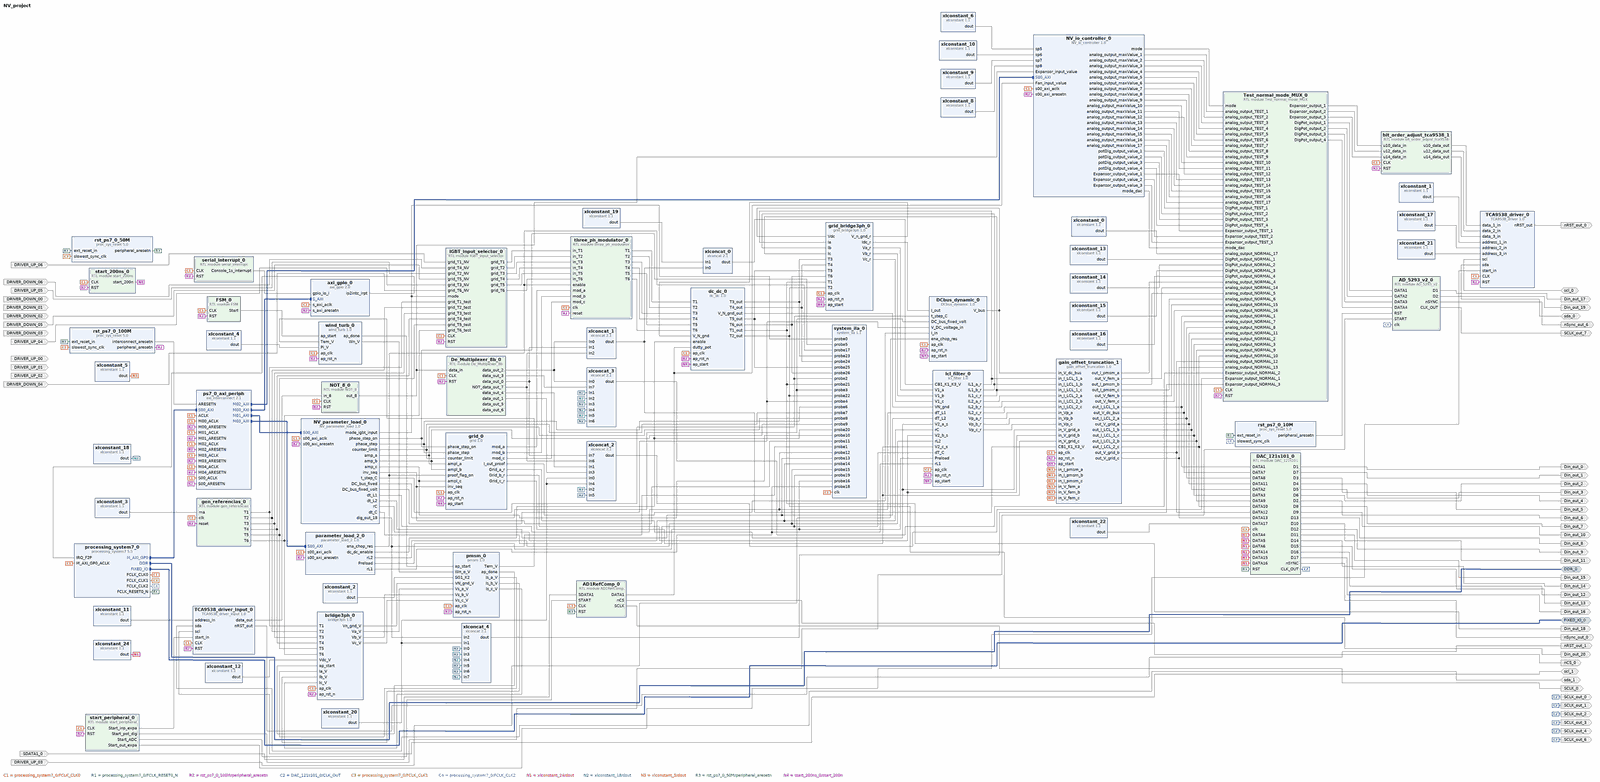
[diagram p0: block diagram of the top level, whole]
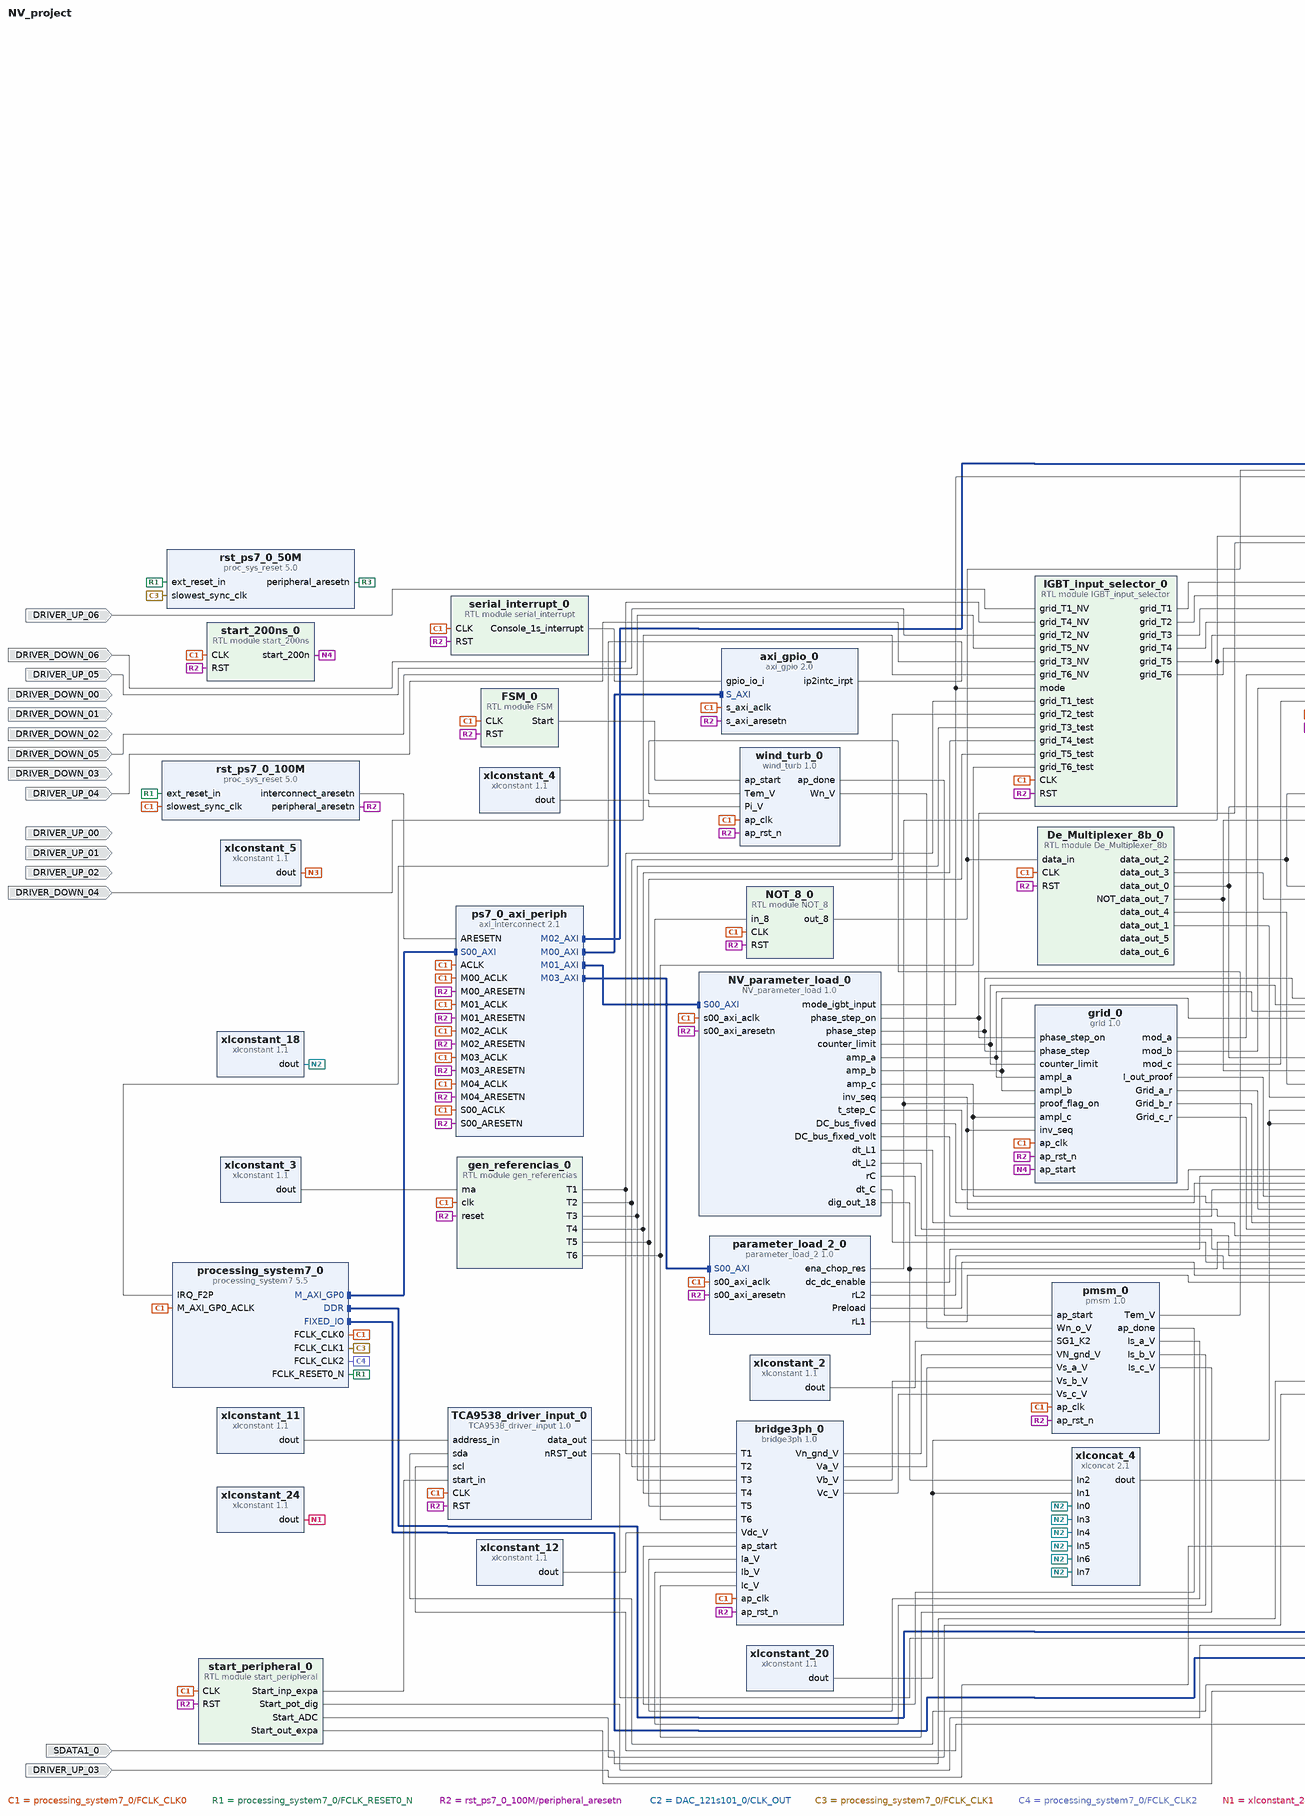
[diagram p1: block diagram of the top level, left part]
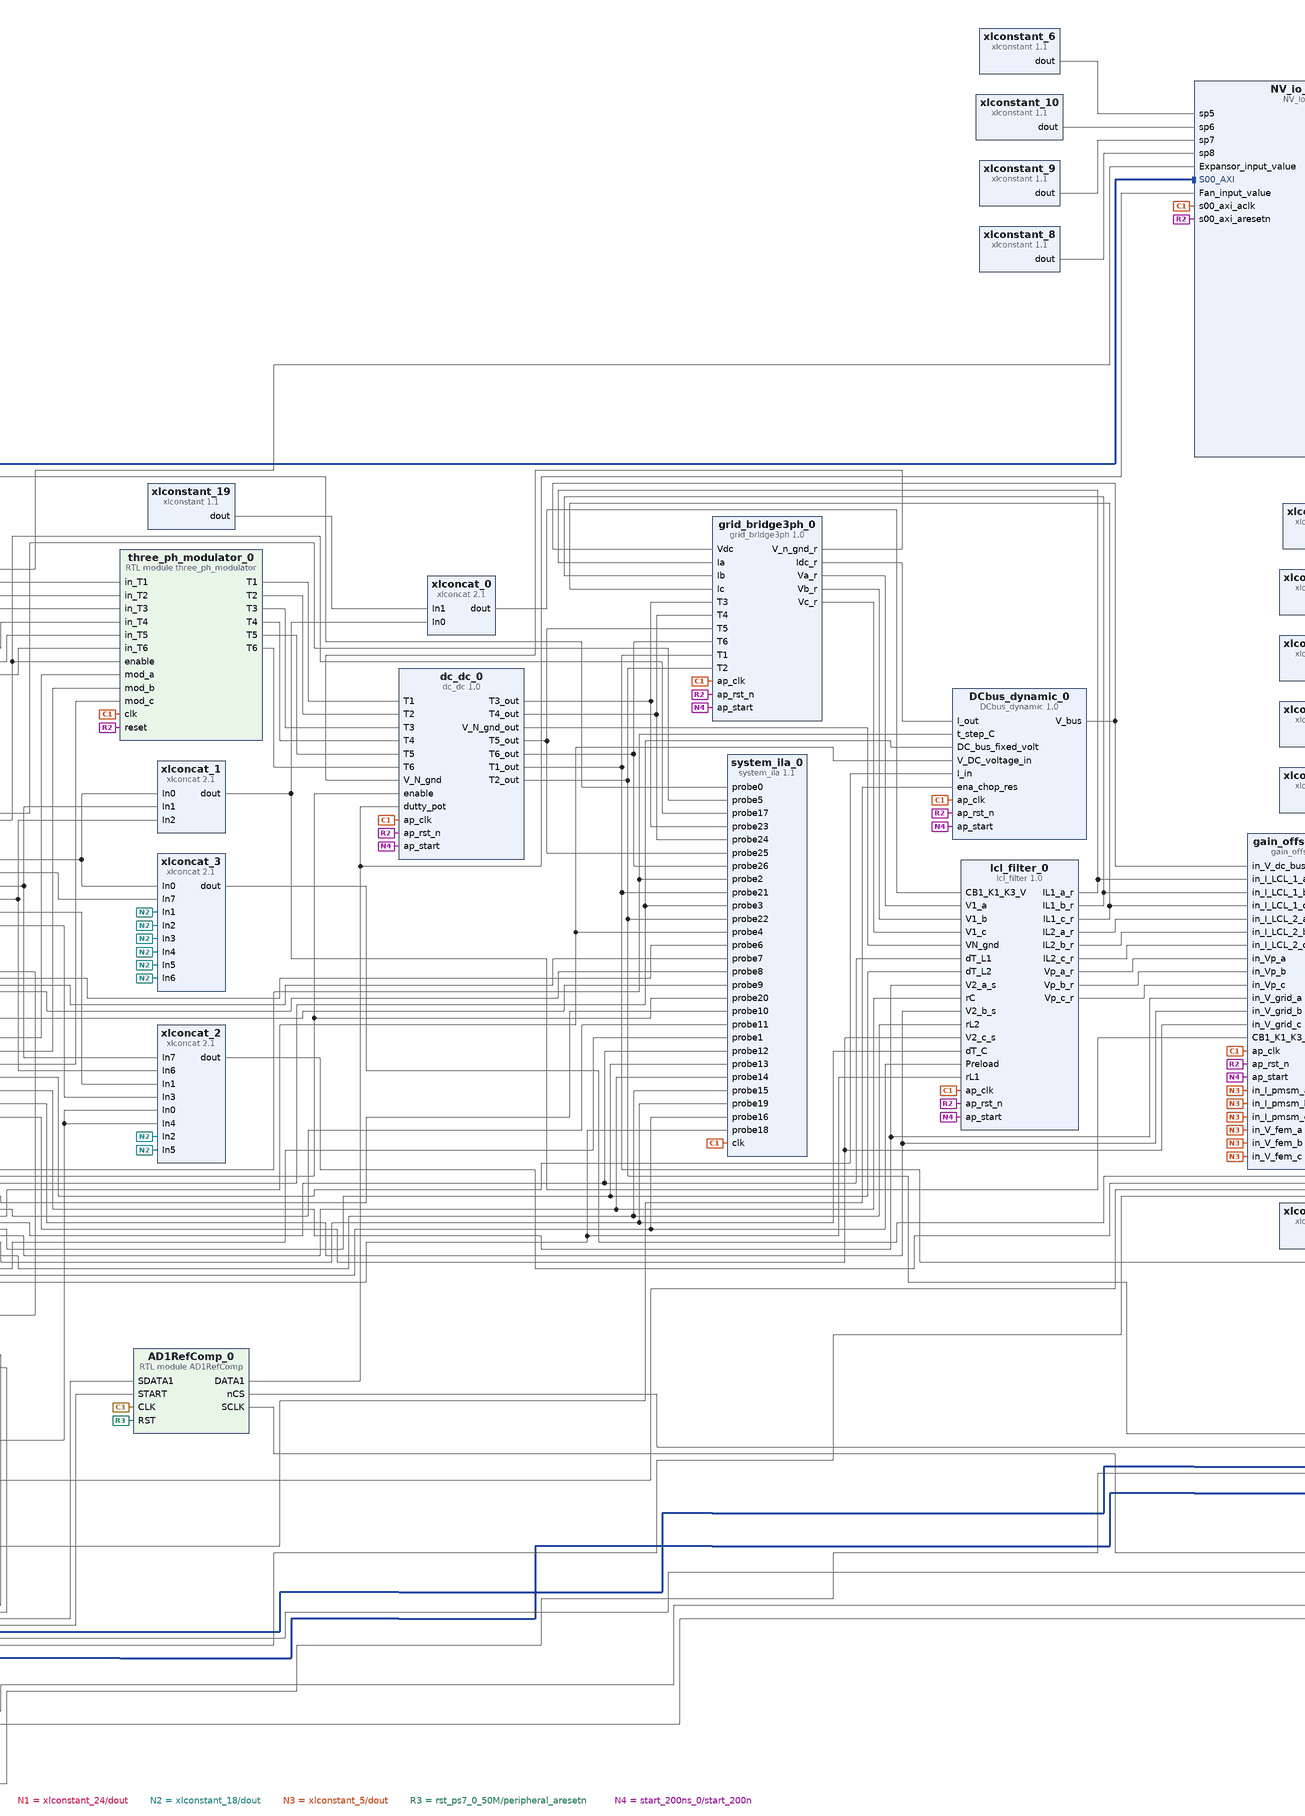
[diagram p2: block diagram of the top level, centre part]
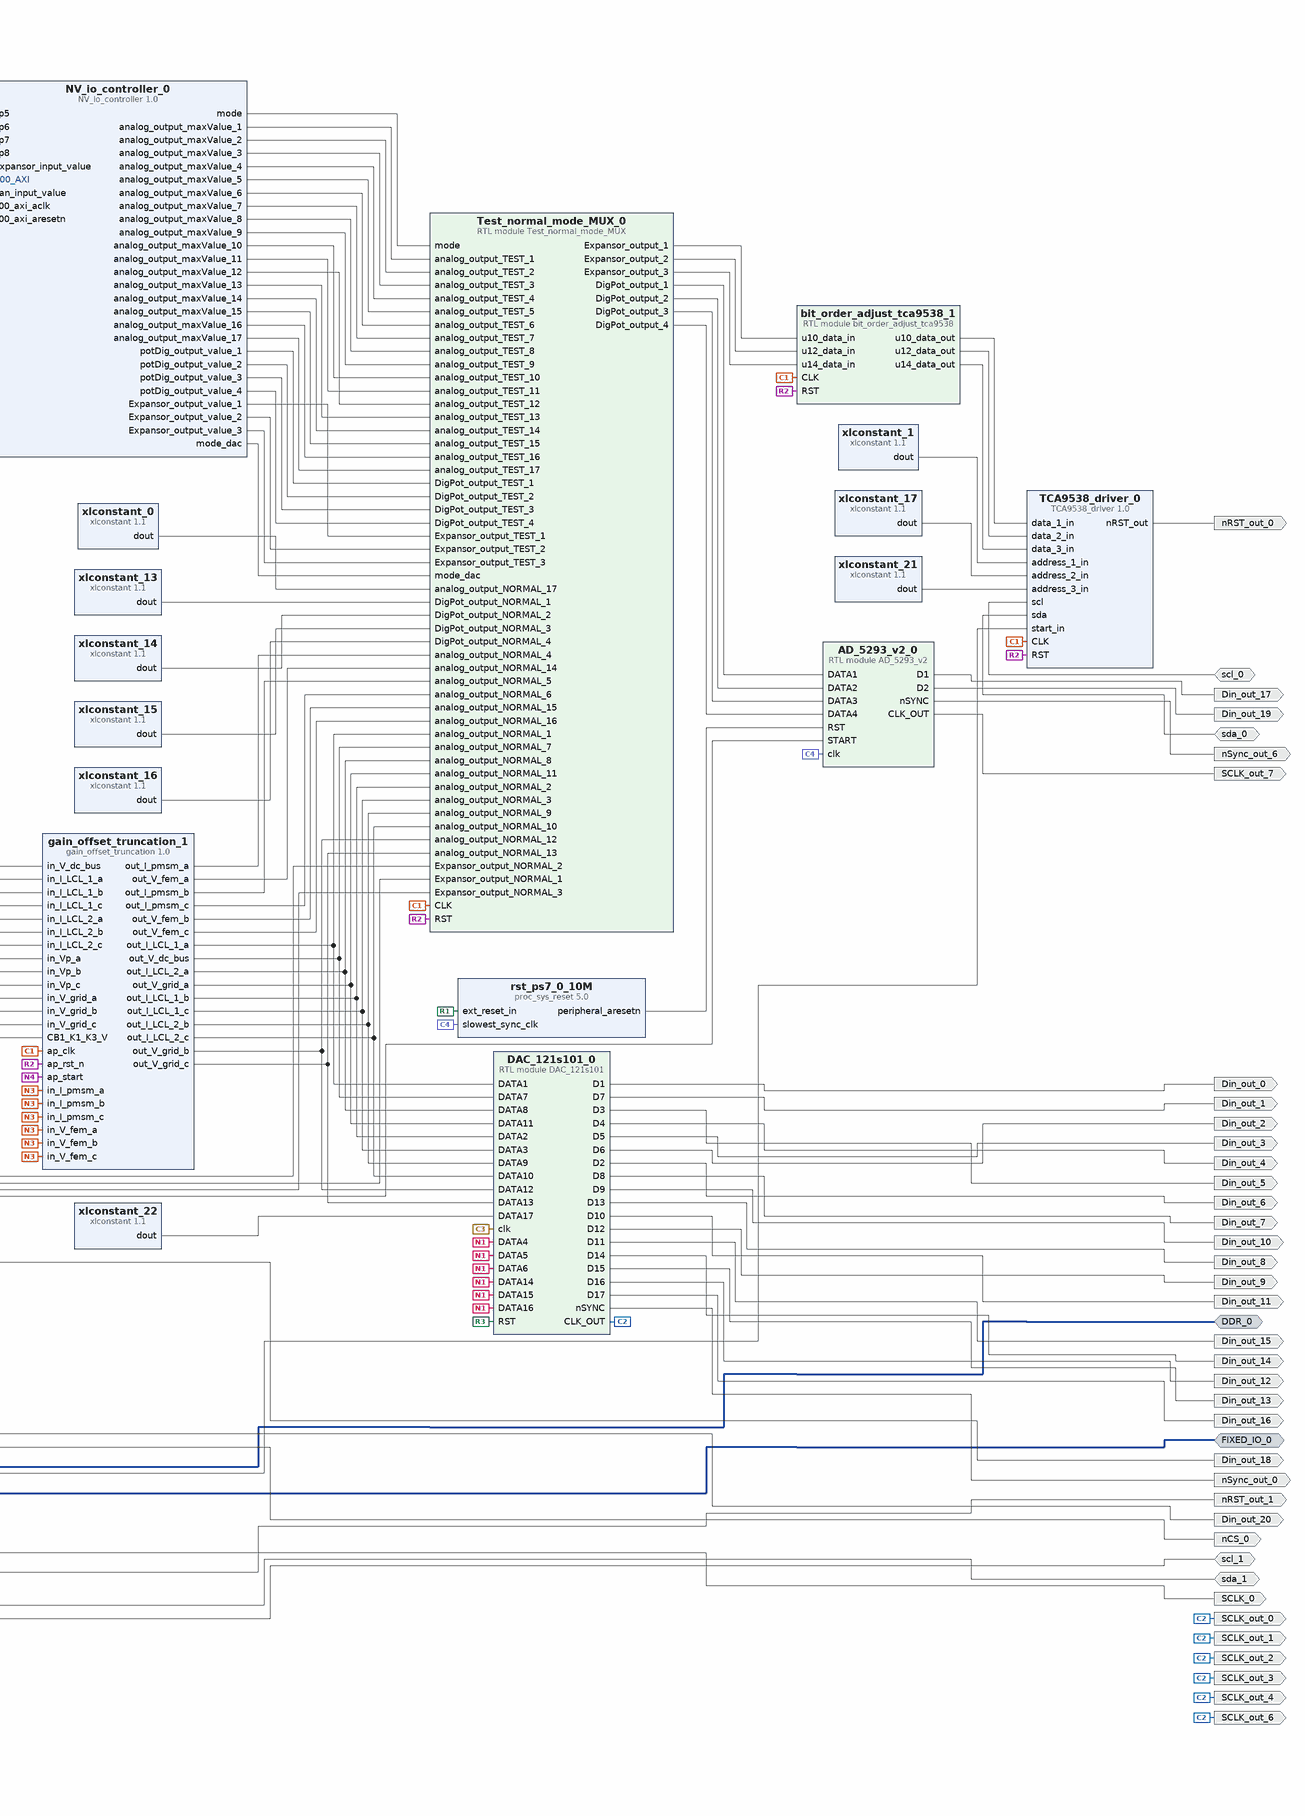
[diagram p3: block diagram of the top level, right part]
# Vivado block design NV_project, xc7z020clg400-1, Vivado 2017.4
create_bd_design NV_project

create_bd_intf_port -mode Master -vlnv xilinx.com:interface:ddrx_rtl:1.0 DDR_0
create_bd_intf_port -mode Master -vlnv xilinx.com:display_processing_system7:fixedio_rtl:1.0 FIXED_IO_0
create_bd_port -dir I DRIVER_DOWN_03
create_bd_port -dir I DRIVER_UP_00
create_bd_port -dir I DRIVER_DOWN_00
create_bd_port -dir I DRIVER_UP_01
create_bd_port -dir I DRIVER_DOWN_01
create_bd_port -dir I DRIVER_UP_02
create_bd_port -dir I DRIVER_DOWN_02
create_bd_port -dir O nRST_out_1
create_bd_port -dir IO sda_1
create_bd_port -dir IO scl_1
create_bd_port -dir O Din_out_0
create_bd_port -dir O Din_out_6
create_bd_port -dir O Din_out_5
create_bd_port -dir O Din_out_4
create_bd_port -dir O Din_out_3
create_bd_port -dir O Din_out_2
create_bd_port -dir O Din_out_1
create_bd_port -dir O Din_out_7
create_bd_port -dir O Din_out_10
create_bd_port -dir O Din_out_11
create_bd_port -dir O Din_out_15
create_bd_port -dir O Din_out_9
create_bd_port -dir O Din_out_8
create_bd_port -dir O Din_out_14
create_bd_port -dir O Din_out_13
create_bd_port -dir O Din_out_12
create_bd_port -dir O Din_out_16
create_bd_port -dir O SCLK_out_0
create_bd_port -dir O SCLK_out_1
create_bd_port -dir O SCLK_out_2
create_bd_port -dir O SCLK_out_3
create_bd_port -dir O SCLK_out_4
create_bd_port -dir O SCLK_out_6
create_bd_port -dir O nSync_out_0
create_bd_port -dir O SCLK_out_7
create_bd_port -dir O nSync_out_6
create_bd_port -dir O Din_out_19
create_bd_port -dir O Din_out_18
create_bd_port -dir O Din_out_20
create_bd_port -dir O nCS_0
create_bd_port -dir O SCLK_0
create_bd_port -dir I SDATA1_0
create_bd_port -dir O nRST_out_0
create_bd_port -dir IO sda_0
create_bd_port -dir IO scl_0
create_bd_port -dir I DRIVER_UP_06
create_bd_port -dir I DRIVER_DOWN_06
create_bd_port -dir I DRIVER_UP_05
create_bd_port -dir I DRIVER_DOWN_05
create_bd_port -dir I DRIVER_UP_04
create_bd_port -dir I DRIVER_DOWN_04
create_bd_port -dir I DRIVER_UP_03
create_bd_port -dir O Din_out_17

create_bd_cell -type ip -vlnv xilinx.com:hls:wind_turb:1.0 wind_turb_0
create_bd_cell -type ip -vlnv xilinx.com:hls:pmsm:1.0 pmsm_0
create_bd_cell -type ip -vlnv xilinx.com:hls:bridge3ph:1.0 bridge3ph_0
create_bd_cell -type ip -vlnv xilinx.com:ip:xlconstant:1.1 xlconstant_2
set_property -dict {CONFIG.CONST_WIDTH 1 CONFIG.CONST_VAL 0} [get_bd_cells xlconstant_2]
create_bd_cell -type ip -vlnv xilinx.com:ip:xlconstant:1.1 xlconstant_3
set_property -dict {CONFIG.CONST_WIDTH 11 CONFIG.CONST_VAL 254} [get_bd_cells xlconstant_3]
create_bd_cell -type ip -vlnv xilinx.com:ip:processing_system7:5.5 processing_system7_0
set_property -dict [list \
  CONFIG.PCW_FCLK_CLK1_BUF TRUE \
  CONFIG.PCW_FCLK_CLK3_BUF TRUE \
  CONFIG.PCW_APU_PERIPHERAL_FREQMHZ 667 \
  CONFIG.PCW_SDIO_PERIPHERAL_FREQMHZ 25 \
  CONFIG.PCW_UART_PERIPHERAL_FREQMHZ 50 \
  CONFIG.PCW_FPGA0_PERIPHERAL_FREQMHZ 100 \
  CONFIG.PCW_FPGA1_PERIPHERAL_FREQMHZ 50 \
  CONFIG.PCW_FPGA2_PERIPHERAL_FREQMHZ 10 \
  CONFIG.PCW_FPGA3_PERIPHERAL_FREQMHZ 2.5 \
  CONFIG.PCW_USE_FABRIC_INTERRUPT 1 \
  CONFIG.PCW_EN_CLK1_PORT 1 \
  CONFIG.PCW_EN_CLK2_PORT 1 \
  CONFIG.PCW_EN_CLK3_PORT 1 \
  CONFIG.PCW_IRQ_F2P_INTR 1 \
  CONFIG.PCW_PRESET_BANK1_VOLTAGE {LVCMOS 1.8V} \
  CONFIG.PCW_UIPARAM_DDR_PARTNO {MT41K256M16 RE-125} \
  CONFIG.PCW_QSPI_PERIPHERAL_ENABLE 1 \
  CONFIG.PCW_QSPI_QSPI_IO {MIO 1 .. 6} \
  CONFIG.PCW_QSPI_GRP_SINGLE_SS_ENABLE 1 \
  CONFIG.PCW_QSPI_GRP_SINGLE_SS_IO {MIO 1 .. 6} \
  CONFIG.PCW_SINGLE_QSPI_DATA_MODE x4 \
  CONFIG.PCW_QSPI_GRP_FBCLK_ENABLE 1 \
  CONFIG.PCW_QSPI_GRP_FBCLK_IO {MIO 8} \
  CONFIG.PCW_ENET0_PERIPHERAL_ENABLE 1 \
  CONFIG.PCW_ENET0_ENET0_IO {MIO 16 .. 27} \
  CONFIG.PCW_ENET0_GRP_MDIO_ENABLE 1 \
  CONFIG.PCW_ENET0_GRP_MDIO_IO {MIO 52 .. 53} \
  CONFIG.PCW_ENET_RESET_ENABLE 1 \
  CONFIG.PCW_ENET_RESET_SELECT {Share reset pin} \
  CONFIG.PCW_ENET0_RESET_ENABLE 0 \
  CONFIG.PCW_SD0_PERIPHERAL_ENABLE 1 \
  CONFIG.PCW_SD0_SD0_IO {MIO 40 .. 45} \
  CONFIG.PCW_SD0_GRP_CD_ENABLE 1 \
  CONFIG.PCW_SD0_GRP_CD_IO {MIO 46} \
  CONFIG.PCW_SD0_GRP_WP_ENABLE 1 \
  CONFIG.PCW_SD0_GRP_WP_IO {MIO 50} \
  CONFIG.PCW_UART1_PERIPHERAL_ENABLE 1 \
  CONFIG.PCW_UART1_UART1_IO {MIO 48 .. 49} \
  CONFIG.PCW_TTC0_PERIPHERAL_ENABLE 1 \
  CONFIG.PCW_TTC0_TTC0_IO EMIO \
  CONFIG.PCW_USB0_PERIPHERAL_ENABLE 1 \
  CONFIG.PCW_USB0_USB0_IO {MIO 28 .. 39} \
  CONFIG.PCW_USB_RESET_ENABLE 1 \
  CONFIG.PCW_USB_RESET_SELECT {Share reset pin} \
  CONFIG.PCW_USB0_RESET_ENABLE 1 \
  CONFIG.PCW_USB0_RESET_IO {MIO 7} \
  CONFIG.PCW_I2C_RESET_ENABLE 0 \
  CONFIG.PCW_GPIO_PERIPHERAL_ENABLE 1 \
  CONFIG.PCW_GPIO_MIO_GPIO_ENABLE 1 \
  CONFIG.PCW_GPIO_MIO_GPIO_IO MIO \
  CONFIG.PCW_FPGA_FCLK1_ENABLE 1 \
  CONFIG.PCW_FPGA_FCLK2_ENABLE 1 \
  CONFIG.PCW_FPGA_FCLK3_ENABLE 1 \
] [get_bd_cells processing_system7_0]
# 272 more settings of processing_system7_0 are not shown: defaults, MIO pin electricals, DDR timing, and values the tool derives
create_bd_cell -type ip -vlnv xilinx.com:ip:axi_gpio:2.0 axi_gpio_0
set_property -dict {CONFIG.C_GPIO_WIDTH 1 CONFIG.C_ALL_INPUTS 1 CONFIG.C_INTERRUPT_PRESENT 1} [get_bd_cells axi_gpio_0]
create_bd_cell -type ip -vlnv xilinx.com:ip:axi_interconnect:2.1 ps7_0_axi_periph
set_property -dict {CONFIG.NUM_MI 5} [get_bd_cells ps7_0_axi_periph]
create_bd_cell -type ip -vlnv xilinx.com:ip:proc_sys_reset:5.0 rst_ps7_0_100M
create_bd_cell -type ip -vlnv xilinx.com:ip:xlconstant:1.1 xlconstant_6
set_property -dict {CONFIG.CONST_WIDTH 16 CONFIG.CONST_VAL 0} [get_bd_cells xlconstant_6]
create_bd_cell -type ip -vlnv xilinx.com:ip:xlconstant:1.1 xlconstant_8
set_property -dict {CONFIG.CONST_WIDTH 16 CONFIG.CONST_VAL 0} [get_bd_cells xlconstant_8]
create_bd_cell -type ip -vlnv xilinx.com:ip:xlconstant:1.1 xlconstant_9
set_property -dict {CONFIG.CONST_WIDTH 16 CONFIG.CONST_VAL 0} [get_bd_cells xlconstant_9]
create_bd_cell -type ip -vlnv xilinx.com:ip:xlconstant:1.1 xlconstant_10
set_property -dict {CONFIG.CONST_WIDTH 16 CONFIG.CONST_VAL 0} [get_bd_cells xlconstant_10]
create_bd_cell -type ip -vlnv xilinx.com:ip:xlconstant:1.1 xlconstant_0
set_property -dict {CONFIG.CONST_WIDTH 12 CONFIG.CONST_VAL 2048} [get_bd_cells xlconstant_0]
create_bd_cell -type ip -vlnv xilinx.com:ip:xlconstant:1.1 xlconstant_13
set_property -dict {CONFIG.CONST_WIDTH 10 CONFIG.CONST_VAL 967} [get_bd_cells xlconstant_13]
create_bd_cell -type ip -vlnv xilinx.com:ip:xlconstant:1.1 xlconstant_14
set_property -dict {CONFIG.CONST_WIDTH 10 CONFIG.CONST_VAL 57} [get_bd_cells xlconstant_14]
create_bd_cell -type ip -vlnv xilinx.com:ip:xlconstant:1.1 xlconstant_15
set_property -dict {CONFIG.CONST_WIDTH 10 CONFIG.CONST_VAL 57} [get_bd_cells xlconstant_15]
create_bd_cell -type ip -vlnv xilinx.com:ip:xlconstant:1.1 xlconstant_16
set_property -dict {CONFIG.CONST_WIDTH 10 CONFIG.CONST_VAL 24} [get_bd_cells xlconstant_16]
create_bd_cell -type ip -vlnv xilinx.com:ip:xlconstant:1.1 xlconstant_18
set_property -dict {CONFIG.CONST_WIDTH 1 CONFIG.CONST_VAL 0} [get_bd_cells xlconstant_18]
create_bd_cell -type ip -vlnv xilinx.com:ip:xlconstant:1.1 xlconstant_1
set_property -dict {CONFIG.CONST_WIDTH 7 CONFIG.CONST_VAL 112} [get_bd_cells xlconstant_1]
create_bd_cell -type ip -vlnv xilinx.com:ip:xlconstant:1.1 xlconstant_17
set_property -dict {CONFIG.CONST_WIDTH 7 CONFIG.CONST_VAL 113} [get_bd_cells xlconstant_17]
create_bd_cell -type ip -vlnv xilinx.com:ip:xlconstant:1.1 xlconstant_21
set_property -dict {CONFIG.CONST_WIDTH 7 CONFIG.CONST_VAL 114} [get_bd_cells xlconstant_21]
create_bd_cell -type module -reference FSM FSM_0
create_bd_cell -type module -reference Test_normal_mode_MUX Test_normal_mode_MUX_0
create_bd_cell -type ip -vlnv xilinx.com:user:NV_io_controller:1.0 NV_io_controller_0
create_bd_cell -type ip -vlnv xilinx.com:ip:xlconstant:1.1 xlconstant_22
set_property -dict {CONFIG.CONST_WIDTH 12 CONFIG.CONST_VAL 2048} [get_bd_cells xlconstant_22]
create_bd_cell -type module -reference NOT_8 NOT_8_0
create_bd_cell -type ip -vlnv xilinx.com:ip:xlconstant:1.1 xlconstant_11
set_property -dict {CONFIG.CONST_WIDTH 7 CONFIG.CONST_VAL 112} [get_bd_cells xlconstant_11]
create_bd_cell -type module -reference DAC_121s101 DAC_121s101_0
create_bd_cell -type module -reference AD_5293_v2 AD_5293_v2_0
create_bd_cell -type ip -vlnv xilinx.com:ip:xlconstant:1.1 xlconstant_24
set_property -dict {CONFIG.CONST_WIDTH 12 CONFIG.CONST_VAL 2048} [get_bd_cells xlconstant_24]
create_bd_cell -type module -reference IGBT_input_selector IGBT_input_selector_0
create_bd_cell -type module -reference AD1RefComp AD1RefComp_0
create_bd_cell -type module -reference gen_referencias gen_referencias_0
create_bd_cell -type ip -vlnv xilinx.com:ip:xlconcat:2.1 xlconcat_1
set_property -dict {CONFIG.NUM_PORTS 3 CONFIG.IN0_WIDTH 1 CONFIG.IN1_WIDTH 1} [get_bd_cells xlconcat_1]
create_bd_cell -type ip -vlnv xilinx.com:ip:xlconcat:2.1 xlconcat_2
set_property -dict {CONFIG.NUM_PORTS 8} [get_bd_cells xlconcat_2]
create_bd_cell -type ip -vlnv xilinx.com:ip:xlconcat:2.1 xlconcat_3
set_property -dict {CONFIG.NUM_PORTS 8} [get_bd_cells xlconcat_3]
create_bd_cell -type ip -vlnv xilinx.com:ip:xlconcat:2.1 xlconcat_4
set_property -dict {CONFIG.NUM_PORTS 8} [get_bd_cells xlconcat_4]
create_bd_cell -type module -reference bit_order_adjust_tca9538 bit_order_adjust_tca9538_1
create_bd_cell -type ip -vlnv xilinx.com:ip:xlconcat:2.1 xlconcat_0
set_property -dict {CONFIG.NUM_PORTS 2 CONFIG.IN0_WIDTH 3 CONFIG.IN1_WIDTH 2} [get_bd_cells xlconcat_0]
create_bd_cell -type ip -vlnv xilinx.com:ip:xlconstant:1.1 xlconstant_19
set_property -dict {CONFIG.CONST_WIDTH 2 CONFIG.CONST_VAL 0} [get_bd_cells xlconstant_19]
create_bd_cell -type ip -vlnv xilinx.com:ip:xlconstant:1.1 xlconstant_5
set_property -dict {CONFIG.CONST_WIDTH 32 CONFIG.CONST_VAL 0} [get_bd_cells xlconstant_5]
create_bd_cell -type ip -vlnv xilinx.com:ip:xlconstant:1.1 xlconstant_20
set_property -dict {CONFIG.CONST_WIDTH 1 CONFIG.CONST_VAL 1} [get_bd_cells xlconstant_20]
create_bd_cell -type ip -vlnv xilinx.com:ip:proc_sys_reset:5.0 rst_ps7_0_50M
create_bd_cell -type ip -vlnv xilinx.com:ip:proc_sys_reset:5.0 rst_ps7_0_10M
create_bd_cell -type ip -vlnv xilinx.com:user:TCA9538_driver_input:1.0 TCA9538_driver_input_0
create_bd_cell -type module -reference start_peripheral start_peripheral_0
create_bd_cell -type ip -vlnv xilinx.com:user:TCA9538_driver:1.0 TCA9538_driver_0
create_bd_cell -type module -reference serial_interrupt serial_interrupt_0
create_bd_cell -type module -reference De_Multiplexer_8b De_Multiplexer_8b_0
create_bd_cell -type ip -vlnv xilinx.com:ip:xlconstant:1.1 xlconstant_12
set_property -dict {CONFIG.CONST_WIDTH 18 CONFIG.CONST_VAL 10} [get_bd_cells xlconstant_12]
create_bd_cell -type ip -vlnv xilinx.com:ip:xlconstant:1.1 xlconstant_4
set_property -dict {CONFIG.CONST_WIDTH 21} [get_bd_cells xlconstant_4]
create_bd_cell -type ip -vlnv xilinx.com:user:NV_parameter_load:1.0 NV_parameter_load_0
create_bd_cell -type module -reference start_200ns start_200ns_0
create_bd_cell -type ip -vlnv xilinx.com:hls:grid_bridge3ph:1.0 grid_bridge3ph_0
create_bd_cell -type ip -vlnv xilinx.com:hls:DCbus_dynamic:1.0 DCbus_dynamic_0
create_bd_cell -type module -reference three_ph_modulator three_ph_modulator_0
create_bd_cell -type ip -vlnv xilinx.com:ip:system_ila:1.1 system_ila_0
set_property -dict [list \
  CONFIG.C_PROBE26_TYPE 1 \
  CONFIG.C_PROBE25_TYPE 1 \
  CONFIG.C_PROBE24_TYPE 1 \
  CONFIG.C_PROBE23_TYPE 1 \
  CONFIG.C_PROBE22_TYPE 1 \
  CONFIG.C_PROBE21_TYPE 1 \
  CONFIG.C_PROBE20_TYPE 1 \
  CONFIG.C_PROBE19_TYPE 1 \
  CONFIG.C_PROBE18_TYPE 1 \
  CONFIG.C_PROBE17_TYPE 1 \
  CONFIG.C_PROBE16_TYPE 1 \
  CONFIG.C_PROBE15_TYPE 1 \
  CONFIG.C_PROBE14_TYPE 1 \
  CONFIG.C_PROBE13_TYPE 1 \
  CONFIG.C_PROBE12_TYPE 1 \
  CONFIG.C_PROBE11_TYPE 1 \
  CONFIG.C_PROBE10_TYPE 1 \
  CONFIG.C_PROBE9_TYPE 1 \
  CONFIG.C_PROBE8_TYPE 1 \
  CONFIG.C_PROBE7_TYPE 1 \
  CONFIG.C_PROBE6_TYPE 1 \
  CONFIG.C_PROBE5_TYPE 1 \
  CONFIG.C_PROBE4_TYPE 1 \
  CONFIG.C_PROBE3_TYPE 1 \
  CONFIG.C_PROBE2_TYPE 1 \
  CONFIG.C_PROBE1_TYPE 1 \
  CONFIG.C_PROBE0_TYPE 1 \
  CONFIG.C_NUM_OF_PROBES 27 \
  CONFIG.C_MON_TYPE NATIVE \
] [get_bd_cells system_ila_0]
create_bd_cell -type ip -vlnv xilinx.com:hls:grid:1.0 grid_0
create_bd_cell -type ip -vlnv xilinx.com:hls:lcl_filter:1.0 lcl_filter_0
create_bd_cell -type ip -vlnv xilinx.com:hls:gain_offset_truncation:1.0 gain_offset_truncation_1
create_bd_cell -type ip -vlnv xilinx.com:hls:dc_dc:1.0 dc_dc_0
create_bd_cell -type ip -vlnv xilinx.com:user:parameter_load_2:1.0 parameter_load_2_0

# ---- connections ----

connect_bd_intf_net [get_bd_intf_pins processing_system7_0/M_AXI_GP0] [get_bd_intf_pins ps7_0_axi_periph/S00_AXI]
connect_bd_intf_net [get_bd_intf_pins ps7_0_axi_periph/M00_AXI] [get_bd_intf_pins axi_gpio_0/S_AXI]
connect_bd_intf_net [get_bd_intf_pins ps7_0_axi_periph/M01_AXI] [get_bd_intf_pins NV_parameter_load_0/S00_AXI]
connect_bd_intf_net [get_bd_intf_pins ps7_0_axi_periph/M02_AXI] [get_bd_intf_pins NV_io_controller_0/S00_AXI]
connect_bd_intf_net [get_bd_intf_pins ps7_0_axi_periph/M03_AXI] [get_bd_intf_pins parameter_load_2_0/S00_AXI]
connect_bd_intf_net [get_bd_intf_ports DDR_0] [get_bd_intf_pins processing_system7_0/DDR]
connect_bd_intf_net [get_bd_intf_ports FIXED_IO_0] [get_bd_intf_pins processing_system7_0/FIXED_IO]
connect_bd_net [get_bd_pins xlconstant_2/dout] [get_bd_pins pmsm_0/SG1_K2]
connect_bd_net [get_bd_pins xlconstant_3/dout] [get_bd_pins gen_referencias_0/ma]
connect_bd_net [get_bd_pins wind_turb_0/ap_done] [get_bd_pins pmsm_0/ap_start]
connect_bd_net [get_bd_pins pmsm_0/ap_done] [get_bd_pins bridge3ph_0/ap_start]
connect_bd_net [get_bd_pins pmsm_0/Tem_V] [get_bd_pins wind_turb_0/Tem_V]
connect_bd_net [get_bd_pins wind_turb_0/Wn_V] [get_bd_pins pmsm_0/Wn_o_V]
connect_bd_net [get_bd_pins bridge3ph_0/Vn_gnd_V] [get_bd_pins pmsm_0/VN_gnd_V]
connect_bd_net [get_bd_pins bridge3ph_0/Va_V] [get_bd_pins pmsm_0/Vs_a_V]
connect_bd_net [get_bd_pins bridge3ph_0/Vb_V] [get_bd_pins pmsm_0/Vs_b_V]
connect_bd_net [get_bd_pins bridge3ph_0/Vc_V] [get_bd_pins pmsm_0/Vs_c_V]
connect_bd_net [get_bd_pins pmsm_0/Is_a_V] [get_bd_pins bridge3ph_0/Ia_V]
connect_bd_net [get_bd_pins pmsm_0/Is_b_V] [get_bd_pins bridge3ph_0/Ib_V]
connect_bd_net [get_bd_pins pmsm_0/Is_c_V] [get_bd_pins bridge3ph_0/Ic_V]
connect_bd_net [get_bd_pins gen_referencias_0/T1] [get_bd_pins bridge3ph_0/T1] [get_bd_pins IGBT_input_selector_0/grid_T1_test]
connect_bd_net [get_bd_pins gen_referencias_0/T2] [get_bd_pins bridge3ph_0/T2] [get_bd_pins IGBT_input_selector_0/grid_T2_test]
connect_bd_net [get_bd_pins gen_referencias_0/T3] [get_bd_pins bridge3ph_0/T3] [get_bd_pins IGBT_input_selector_0/grid_T3_test]
connect_bd_net [get_bd_pins gen_referencias_0/T4] [get_bd_pins bridge3ph_0/T4] [get_bd_pins IGBT_input_selector_0/grid_T4_test]
connect_bd_net [get_bd_pins gen_referencias_0/T5] [get_bd_pins bridge3ph_0/T5] [get_bd_pins IGBT_input_selector_0/grid_T5_test]
connect_bd_net [get_bd_pins gen_referencias_0/T6] [get_bd_pins bridge3ph_0/T6] [get_bd_pins IGBT_input_selector_0/grid_T6_test]
connect_bd_net [get_bd_pins processing_system7_0/FCLK_CLK0] \
  [get_bd_pins processing_system7_0/M_AXI_GP0_ACLK] [get_bd_pins rst_ps7_0_100M/slowest_sync_clk] \
  [get_bd_pins axi_gpio_0/s_axi_aclk] [get_bd_pins wind_turb_0/ap_clk] [get_bd_pins pmsm_0/ap_clk] \
  [get_bd_pins bridge3ph_0/ap_clk] [get_bd_pins FSM_0/CLK] [get_bd_pins Test_normal_mode_MUX_0/CLK] \
  [get_bd_pins NV_io_controller_0/s00_axi_aclk] [get_bd_pins NOT_8_0/CLK] [get_bd_pins IGBT_input_selector_0/CLK] \
  [get_bd_pins gen_referencias_0/clk] [get_bd_pins bit_order_adjust_tca9538_1/CLK] [get_bd_pins TCA9538_driver_input_0/CLK] \
  [get_bd_pins start_peripheral_0/CLK] [get_bd_pins TCA9538_driver_0/CLK] [get_bd_pins serial_interrupt_0/CLK] \
  [get_bd_pins De_Multiplexer_8b_0/CLK] [get_bd_pins NV_parameter_load_0/s00_axi_aclk] [get_bd_pins start_200ns_0/CLK] \
  [get_bd_pins grid_bridge3ph_0/ap_clk] [get_bd_pins DCbus_dynamic_0/ap_clk] [get_bd_pins three_ph_modulator_0/clk] \
  [get_bd_pins system_ila_0/clk] [get_bd_pins grid_0/ap_clk] [get_bd_pins lcl_filter_0/ap_clk] \
  [get_bd_pins gain_offset_truncation_1/ap_clk] [get_bd_pins dc_dc_0/ap_clk] [get_bd_pins parameter_load_2_0/s00_axi_aclk] \
  [get_bd_pins ps7_0_axi_periph/S00_ACLK] [get_bd_pins ps7_0_axi_periph/M00_ACLK] [get_bd_pins ps7_0_axi_periph/ACLK] \
  [get_bd_pins ps7_0_axi_periph/M01_ACLK] [get_bd_pins ps7_0_axi_periph/M02_ACLK] [get_bd_pins ps7_0_axi_periph/M03_ACLK] \
  [get_bd_pins ps7_0_axi_periph/M04_ACLK]
connect_bd_net [get_bd_pins processing_system7_0/FCLK_RESET0_N] \
  [get_bd_pins rst_ps7_0_100M/ext_reset_in] [get_bd_pins rst_ps7_0_50M/ext_reset_in] [get_bd_pins rst_ps7_0_10M/ext_reset_in]
connect_bd_net [get_bd_pins rst_ps7_0_100M/peripheral_aresetn] \
  [get_bd_pins axi_gpio_0/s_axi_aresetn] [get_bd_pins wind_turb_0/ap_rst_n] [get_bd_pins pmsm_0/ap_rst_n] \
  [get_bd_pins bridge3ph_0/ap_rst_n] [get_bd_pins FSM_0/RST] [get_bd_pins Test_normal_mode_MUX_0/RST] \
  [get_bd_pins NV_io_controller_0/s00_axi_aresetn] [get_bd_pins NOT_8_0/RST] [get_bd_pins IGBT_input_selector_0/RST] \
  [get_bd_pins gen_referencias_0/reset] [get_bd_pins bit_order_adjust_tca9538_1/RST] [get_bd_pins TCA9538_driver_input_0/RST] \
  [get_bd_pins start_peripheral_0/RST] [get_bd_pins TCA9538_driver_0/RST] [get_bd_pins serial_interrupt_0/RST] \
  [get_bd_pins De_Multiplexer_8b_0/RST] [get_bd_pins NV_parameter_load_0/s00_axi_aresetn] [get_bd_pins start_200ns_0/RST] \
  [get_bd_pins grid_bridge3ph_0/ap_rst_n] [get_bd_pins DCbus_dynamic_0/ap_rst_n] [get_bd_pins three_ph_modulator_0/reset] \
  [get_bd_pins grid_0/ap_rst_n] [get_bd_pins lcl_filter_0/ap_rst_n] [get_bd_pins gain_offset_truncation_1/ap_rst_n] \
  [get_bd_pins dc_dc_0/ap_rst_n] [get_bd_pins parameter_load_2_0/s00_axi_aresetn] [get_bd_pins ps7_0_axi_periph/S00_ARESETN] \
  [get_bd_pins ps7_0_axi_periph/M00_ARESETN] [get_bd_pins ps7_0_axi_periph/M01_ARESETN] \
  [get_bd_pins ps7_0_axi_periph/M02_ARESETN] [get_bd_pins ps7_0_axi_periph/M03_ARESETN] \
  [get_bd_pins ps7_0_axi_periph/M04_ARESETN]
connect_bd_net [get_bd_pins rst_ps7_0_100M/interconnect_aresetn] [get_bd_pins ps7_0_axi_periph/ARESETN]
connect_bd_net [get_bd_pins xlconstant_6/dout] [get_bd_pins NV_io_controller_0/sp5]
connect_bd_net [get_bd_pins xlconstant_10/dout] [get_bd_pins NV_io_controller_0/sp6]
connect_bd_net [get_bd_pins xlconstant_9/dout] [get_bd_pins NV_io_controller_0/sp7]
connect_bd_net [get_bd_pins xlconstant_8/dout] [get_bd_pins NV_io_controller_0/sp8]
connect_bd_net [get_bd_pins NV_io_controller_0/mode] [get_bd_pins Test_normal_mode_MUX_0/mode]
connect_bd_net [get_bd_pins NV_io_controller_0/analog_output_maxValue_1] [get_bd_pins Test_normal_mode_MUX_0/analog_output_TEST_1]
connect_bd_net [get_bd_pins NV_io_controller_0/analog_output_maxValue_2] [get_bd_pins Test_normal_mode_MUX_0/analog_output_TEST_2]
connect_bd_net [get_bd_pins NV_io_controller_0/analog_output_maxValue_3] [get_bd_pins Test_normal_mode_MUX_0/analog_output_TEST_3]
connect_bd_net [get_bd_pins NV_io_controller_0/analog_output_maxValue_4] [get_bd_pins Test_normal_mode_MUX_0/analog_output_TEST_4]
connect_bd_net [get_bd_pins NV_io_controller_0/analog_output_maxValue_5] [get_bd_pins Test_normal_mode_MUX_0/analog_output_TEST_5]
connect_bd_net [get_bd_pins NV_io_controller_0/analog_output_maxValue_6] [get_bd_pins Test_normal_mode_MUX_0/analog_output_TEST_6]
connect_bd_net [get_bd_pins NV_io_controller_0/analog_output_maxValue_7] [get_bd_pins Test_normal_mode_MUX_0/analog_output_TEST_7]
connect_bd_net [get_bd_pins NV_io_controller_0/analog_output_maxValue_8] [get_bd_pins Test_normal_mode_MUX_0/analog_output_TEST_8]
connect_bd_net [get_bd_pins NV_io_controller_0/analog_output_maxValue_9] [get_bd_pins Test_normal_mode_MUX_0/analog_output_TEST_9]
connect_bd_net [get_bd_pins NV_io_controller_0/analog_output_maxValue_10] [get_bd_pins Test_normal_mode_MUX_0/analog_output_TEST_10]
connect_bd_net [get_bd_pins NV_io_controller_0/analog_output_maxValue_11] [get_bd_pins Test_normal_mode_MUX_0/analog_output_TEST_11]
connect_bd_net [get_bd_pins NV_io_controller_0/analog_output_maxValue_12] [get_bd_pins Test_normal_mode_MUX_0/analog_output_TEST_12]
connect_bd_net [get_bd_pins NV_io_controller_0/analog_output_maxValue_13] [get_bd_pins Test_normal_mode_MUX_0/analog_output_TEST_13]
connect_bd_net [get_bd_pins NV_io_controller_0/analog_output_maxValue_14] [get_bd_pins Test_normal_mode_MUX_0/analog_output_TEST_14]
connect_bd_net [get_bd_pins NV_io_controller_0/analog_output_maxValue_15] [get_bd_pins Test_normal_mode_MUX_0/analog_output_TEST_15]
connect_bd_net [get_bd_pins NV_io_controller_0/analog_output_maxValue_16] [get_bd_pins Test_normal_mode_MUX_0/analog_output_TEST_16]
connect_bd_net [get_bd_pins NV_io_controller_0/analog_output_maxValue_17] [get_bd_pins Test_normal_mode_MUX_0/analog_output_TEST_17]
connect_bd_net [get_bd_pins NV_io_controller_0/potDig_output_value_1] [get_bd_pins Test_normal_mode_MUX_0/DigPot_output_TEST_1]
connect_bd_net [get_bd_pins NV_io_controller_0/potDig_output_value_2] [get_bd_pins Test_normal_mode_MUX_0/DigPot_output_TEST_2]
connect_bd_net [get_bd_pins NV_io_controller_0/potDig_output_value_3] [get_bd_pins Test_normal_mode_MUX_0/DigPot_output_TEST_3]
connect_bd_net [get_bd_pins NV_io_controller_0/potDig_output_value_4] [get_bd_pins Test_normal_mode_MUX_0/DigPot_output_TEST_4]
connect_bd_net [get_bd_pins NV_io_controller_0/Expansor_output_value_1] [get_bd_pins Test_normal_mode_MUX_0/Expansor_output_TEST_1]
connect_bd_net [get_bd_pins NV_io_controller_0/Expansor_output_value_2] [get_bd_pins Test_normal_mode_MUX_0/Expansor_output_TEST_2]
connect_bd_net [get_bd_pins NV_io_controller_0/Expansor_output_value_3] [get_bd_pins Test_normal_mode_MUX_0/Expansor_output_TEST_3]
connect_bd_net [get_bd_pins xlconstant_0/dout] [get_bd_pins Test_normal_mode_MUX_0/analog_output_NORMAL_17]
connect_bd_net [get_bd_pins xlconstant_13/dout] [get_bd_pins Test_normal_mode_MUX_0/DigPot_output_NORMAL_1]
connect_bd_net [get_bd_pins xlconstant_14/dout] [get_bd_pins Test_normal_mode_MUX_0/DigPot_output_NORMAL_2]
connect_bd_net [get_bd_pins xlconstant_15/dout] [get_bd_pins Test_normal_mode_MUX_0/DigPot_output_NORMAL_3]
connect_bd_net [get_bd_pins xlconstant_16/dout] [get_bd_pins Test_normal_mode_MUX_0/DigPot_output_NORMAL_4]
connect_bd_net [get_bd_pins start_peripheral_0/Start_pot_dig] [get_bd_pins AD_5293_v2_0/START]
connect_bd_net [get_bd_pins start_peripheral_0/Start_out_expa] [get_bd_pins TCA9538_driver_0/start_in]
connect_bd_net [get_bd_pins xlconstant_1/dout] [get_bd_pins TCA9538_driver_0/address_1_in]
connect_bd_net [get_bd_pins xlconstant_17/dout] [get_bd_pins TCA9538_driver_0/address_2_in]
connect_bd_net [get_bd_pins xlconstant_21/dout] [get_bd_pins TCA9538_driver_0/address_3_in]
connect_bd_net [get_bd_pins Test_normal_mode_MUX_0/DigPot_output_1] [get_bd_pins AD_5293_v2_0/DATA1]
connect_bd_net [get_bd_pins Test_normal_mode_MUX_0/DigPot_output_2] [get_bd_pins AD_5293_v2_0/DATA2]
connect_bd_net [get_bd_pins Test_normal_mode_MUX_0/DigPot_output_3] [get_bd_pins AD_5293_v2_0/DATA3]
connect_bd_net [get_bd_pins Test_normal_mode_MUX_0/DigPot_output_4] [get_bd_pins AD_5293_v2_0/DATA4]
connect_bd_net -net gain_offset_truncation_0_out_I_LCL_1_a_V [get_bd_pins gain_offset_truncation_1/out_I_LCL_1_a] \
  [get_bd_pins Test_normal_mode_MUX_0/analog_output_NORMAL_1] [get_bd_pins DAC_121s101_0/DATA1]
connect_bd_net -net gain_offset_truncation_0_out_I_pmsm_a_V [get_bd_pins gain_offset_truncation_1/out_I_pmsm_a] \
  [get_bd_pins Test_normal_mode_MUX_0/analog_output_NORMAL_4]
connect_bd_net -net gain_offset_truncation_0_out_V_dc_bus_V [get_bd_pins gain_offset_truncation_1/out_V_dc_bus] \
  [get_bd_pins Test_normal_mode_MUX_0/analog_output_NORMAL_7] [get_bd_pins DAC_121s101_0/DATA7]
connect_bd_net -net gain_offset_truncation_0_out_I_LCL_2_a_V [get_bd_pins gain_offset_truncation_1/out_I_LCL_2_a] \
  [get_bd_pins Test_normal_mode_MUX_0/analog_output_NORMAL_8] [get_bd_pins DAC_121s101_0/DATA8]
connect_bd_net -net gain_offset_truncation_0_out_V_grid_a_V [get_bd_pins gain_offset_truncation_1/out_V_grid_a] \
  [get_bd_pins Test_normal_mode_MUX_0/analog_output_NORMAL_11] [get_bd_pins DAC_121s101_0/DATA11]
connect_bd_net -net gain_offset_truncation_0_out_V_fem_a_V [get_bd_pins gain_offset_truncation_1/out_V_fem_a] \
  [get_bd_pins Test_normal_mode_MUX_0/analog_output_NORMAL_14]
connect_bd_net -net gain_offset_truncation_1_out_I_LCL_1_b_V [get_bd_pins gain_offset_truncation_1/out_I_LCL_1_b] \
  [get_bd_pins Test_normal_mode_MUX_0/analog_output_NORMAL_2] [get_bd_pins DAC_121s101_0/DATA2]
connect_bd_net -net gain_offset_truncation_1_out_I_LCL_1_c_V [get_bd_pins gain_offset_truncation_1/out_I_LCL_1_c] \
  [get_bd_pins Test_normal_mode_MUX_0/analog_output_NORMAL_3] [get_bd_pins DAC_121s101_0/DATA3]
connect_bd_net -net gain_offset_truncation_1_out_I_pmsm_b_V [get_bd_pins gain_offset_truncation_1/out_I_pmsm_b] \
  [get_bd_pins Test_normal_mode_MUX_0/analog_output_NORMAL_5]
connect_bd_net -net gain_offset_truncation_1_out_I_pmsm_c_V [get_bd_pins gain_offset_truncation_1/out_I_pmsm_c] \
  [get_bd_pins Test_normal_mode_MUX_0/analog_output_NORMAL_6]
connect_bd_net -net gain_offset_truncation_1_out_I_LCL_2_b_V [get_bd_pins gain_offset_truncation_1/out_I_LCL_2_b] \
  [get_bd_pins Test_normal_mode_MUX_0/analog_output_NORMAL_9] [get_bd_pins DAC_121s101_0/DATA9]
connect_bd_net -net gain_offset_truncation_1_out_I_LCL_2_c_V [get_bd_pins gain_offset_truncation_1/out_I_LCL_2_c] \
  [get_bd_pins Test_normal_mode_MUX_0/analog_output_NORMAL_10] [get_bd_pins DAC_121s101_0/DATA10]
connect_bd_net -net gain_offset_truncation_1_out_V_grid_b_V [get_bd_pins gain_offset_truncation_1/out_V_grid_b] \
  [get_bd_pins Test_normal_mode_MUX_0/analog_output_NORMAL_12] [get_bd_pins DAC_121s101_0/DATA12]
connect_bd_net -net gain_offset_truncation_1_out_V_grid_c_V [get_bd_pins gain_offset_truncation_1/out_V_grid_c] \
  [get_bd_pins Test_normal_mode_MUX_0/analog_output_NORMAL_13] [get_bd_pins DAC_121s101_0/DATA13]
connect_bd_net -net gain_offset_truncation_1_out_V_fem_b_V [get_bd_pins gain_offset_truncation_1/out_V_fem_b] \
  [get_bd_pins Test_normal_mode_MUX_0/analog_output_NORMAL_15]
connect_bd_net -net gain_offset_truncation_1_out_V_fem_c_V [get_bd_pins gain_offset_truncation_1/out_V_fem_c] \
  [get_bd_pins Test_normal_mode_MUX_0/analog_output_NORMAL_16]
connect_bd_net [get_bd_pins NV_io_controller_0/mode_dac] [get_bd_pins Test_normal_mode_MUX_0/mode_dac]
connect_bd_net [get_bd_pins xlconstant_22/dout] [get_bd_pins DAC_121s101_0/DATA17]
connect_bd_net [get_bd_pins TCA9538_driver_input_0/data_out] [get_bd_pins NOT_8_0/in_8]
connect_bd_net [get_bd_pins NOT_8_0/out_8] [get_bd_pins NV_io_controller_0/Expansor_input_value] [get_bd_pins De_Multiplexer_8b_0/data_in]
connect_bd_net [get_bd_pins start_peripheral_0/Start_inp_expa] [get_bd_pins TCA9538_driver_input_0/start_in]
connect_bd_net [get_bd_pins xlconstant_11/dout] [get_bd_pins TCA9538_driver_input_0/address_in]
connect_bd_net [get_bd_pins TCA9538_driver_input_0/nRST_out] [get_bd_ports nRST_out_1]
connect_bd_net [get_bd_ports sda_1] [get_bd_pins TCA9538_driver_input_0/sda]
connect_bd_net [get_bd_ports scl_1] [get_bd_pins TCA9538_driver_input_0/scl]
connect_bd_net [get_bd_pins DAC_121s101_0/D1] [get_bd_ports Din_out_0]
connect_bd_net [get_bd_pins DAC_121s101_0/D2] [get_bd_ports Din_out_6]
connect_bd_net [get_bd_pins DAC_121s101_0/D3] [get_bd_ports Din_out_5]
connect_bd_net [get_bd_pins DAC_121s101_0/D4] [get_bd_ports Din_out_4]
connect_bd_net [get_bd_pins DAC_121s101_0/D5] [get_bd_ports Din_out_3]
connect_bd_net [get_bd_pins DAC_121s101_0/D6] [get_bd_ports Din_out_2]
connect_bd_net [get_bd_pins DAC_121s101_0/D7] [get_bd_ports Din_out_1]
connect_bd_net [get_bd_pins DAC_121s101_0/D8] [get_bd_ports Din_out_7]
connect_bd_net [get_bd_pins DAC_121s101_0/D9] [get_bd_ports Din_out_10]
connect_bd_net [get_bd_pins DAC_121s101_0/D10] [get_bd_ports Din_out_11]
connect_bd_net [get_bd_pins DAC_121s101_0/D11] [get_bd_ports Din_out_15]
connect_bd_net [get_bd_pins DAC_121s101_0/D12] [get_bd_ports Din_out_9]
connect_bd_net [get_bd_pins DAC_121s101_0/D13] [get_bd_ports Din_out_8]
connect_bd_net [get_bd_pins DAC_121s101_0/D14] [get_bd_ports Din_out_14]
connect_bd_net [get_bd_pins DAC_121s101_0/D15] [get_bd_ports Din_out_13]
connect_bd_net [get_bd_pins DAC_121s101_0/D16] [get_bd_ports Din_out_12]
connect_bd_net [get_bd_pins DAC_121s101_0/D17] [get_bd_ports Din_out_16]
connect_bd_net [get_bd_pins DAC_121s101_0/CLK_OUT] \
  [get_bd_ports SCLK_out_6] [get_bd_ports SCLK_out_4] [get_bd_ports SCLK_out_3] [get_bd_ports SCLK_out_2] \
  [get_bd_ports SCLK_out_1] [get_bd_ports SCLK_out_0]
connect_bd_net [get_bd_pins DAC_121s101_0/nSYNC] [get_bd_ports nSync_out_0]
connect_bd_net [get_bd_pins AD_5293_v2_0/CLK_OUT] [get_bd_ports SCLK_out_7]
connect_bd_net [get_bd_pins AD_5293_v2_0/nSYNC] [get_bd_ports nSync_out_6]
connect_bd_net [get_bd_pins AD_5293_v2_0/D2] [get_bd_ports Din_out_19]
connect_bd_net [get_bd_pins processing_system7_0/FCLK_CLK1] \
  [get_bd_pins DAC_121s101_0/clk] [get_bd_pins AD1RefComp_0/CLK] [get_bd_pins rst_ps7_0_50M/slowest_sync_clk]
connect_bd_net [get_bd_pins processing_system7_0/FCLK_CLK2] [get_bd_pins rst_ps7_0_10M/slowest_sync_clk] [get_bd_pins AD_5293_v2_0/clk]
connect_bd_net [get_bd_pins AD1RefComp_0/DATA1] [get_bd_pins NV_io_controller_0/Fan_input_value] [get_bd_pins dc_dc_0/dutty_pot]
connect_bd_net [get_bd_pins AD1RefComp_0/nCS] [get_bd_ports nCS_0]
connect_bd_net [get_bd_pins AD1RefComp_0/SCLK] [get_bd_ports SCLK_0]
connect_bd_net -net SDATA1_0_1 [get_bd_ports SDATA1_0] [get_bd_pins AD1RefComp_0/SDATA1]
connect_bd_net [get_bd_pins TCA9538_driver_0/nRST_out] [get_bd_ports nRST_out_0]
connect_bd_net [get_bd_ports sda_0] [get_bd_pins TCA9538_driver_0/sda]
connect_bd_net [get_bd_ports scl_0] [get_bd_pins TCA9538_driver_0/scl]
connect_bd_net [get_bd_pins xlconstant_24/dout] \
  [get_bd_pins DAC_121s101_0/DATA4] [get_bd_pins DAC_121s101_0/DATA5] [get_bd_pins DAC_121s101_0/DATA6] \
  [get_bd_pins DAC_121s101_0/DATA14] [get_bd_pins DAC_121s101_0/DATA15] [get_bd_pins DAC_121s101_0/DATA16]
connect_bd_net [get_bd_pins NV_parameter_load_0/mode_igbt_input] [get_bd_pins IGBT_input_selector_0/mode] [get_bd_pins system_ila_0/probe0]
connect_bd_net [get_bd_pins start_peripheral_0/Start_ADC] [get_bd_pins AD1RefComp_0/START]
connect_bd_net [get_bd_pins De_Multiplexer_8b_0/data_out_0] [get_bd_pins xlconcat_1/In1] [get_bd_pins xlconcat_2/In7]
connect_bd_net [get_bd_pins De_Multiplexer_8b_0/data_out_2] [get_bd_pins xlconcat_1/In0] [get_bd_pins xlconcat_3/In0]
connect_bd_net [get_bd_pins xlconcat_1/dout] [get_bd_pins xlconcat_0/In0] [get_bd_pins gain_offset_truncation_1/CB1_K1_K3_V]
connect_bd_net -net DRIVER_UP_06_1 [get_bd_ports DRIVER_UP_06] [get_bd_pins IGBT_input_selector_0/grid_T1_NV]
connect_bd_net -net DRIVER_DOWN_06_1 [get_bd_ports DRIVER_DOWN_06] [get_bd_pins IGBT_input_selector_0/grid_T4_NV]
connect_bd_net -net DRIVER_UP_05_1 [get_bd_ports DRIVER_UP_05] [get_bd_pins IGBT_input_selector_0/grid_T2_NV]
connect_bd_net -net DRIVER_DOWN_05_1 [get_bd_ports DRIVER_DOWN_05] [get_bd_pins IGBT_input_selector_0/grid_T5_NV]
connect_bd_net -net DRIVER_UP_04_1 [get_bd_ports DRIVER_UP_04] [get_bd_pins IGBT_input_selector_0/grid_T3_NV]
connect_bd_net -net DRIVER_DOWN_04_1 [get_bd_ports DRIVER_DOWN_04] [get_bd_pins IGBT_input_selector_0/grid_T6_NV]
connect_bd_net [get_bd_pins De_Multiplexer_8b_0/data_out_4] [get_bd_pins xlconcat_2/In1]
connect_bd_net [get_bd_pins De_Multiplexer_8b_0/data_out_1] [get_bd_pins xlconcat_2/In3]
connect_bd_net [get_bd_pins xlconcat_2/dout] [get_bd_pins Test_normal_mode_MUX_0/Expansor_output_NORMAL_1]
connect_bd_net [get_bd_pins De_Multiplexer_8b_0/data_out_3] [get_bd_pins xlconcat_3/In7]
connect_bd_net [get_bd_pins xlconcat_3/dout] [get_bd_pins Test_normal_mode_MUX_0/Expansor_output_NORMAL_2]
connect_bd_net [get_bd_pins xlconstant_18/dout] \
  [get_bd_pins xlconcat_4/In7] [get_bd_pins xlconcat_4/In6] [get_bd_pins xlconcat_4/In5] [get_bd_pins xlconcat_4/In4] \
  [get_bd_pins xlconcat_4/In3] [get_bd_pins xlconcat_4/In0] [get_bd_pins xlconcat_3/In6] [get_bd_pins xlconcat_3/In5] \
  [get_bd_pins xlconcat_3/In4] [get_bd_pins xlconcat_3/In3] [get_bd_pins xlconcat_3/In2] [get_bd_pins xlconcat_3/In1] \
  [get_bd_pins xlconcat_2/In5] [get_bd_pins xlconcat_2/In2]
connect_bd_net [get_bd_pins xlconcat_4/dout] [get_bd_pins Test_normal_mode_MUX_0/Expansor_output_NORMAL_3]
# net data_out_5 has one end: De_Multiplexer_8b_0/data_out_5
# net data_out_6 has one end: De_Multiplexer_8b_0/data_out_6
connect_bd_net [get_bd_pins Test_normal_mode_MUX_0/Expansor_output_1] [get_bd_pins bit_order_adjust_tca9538_1/u10_data_in]
connect_bd_net [get_bd_pins Test_normal_mode_MUX_0/Expansor_output_2] [get_bd_pins bit_order_adjust_tca9538_1/u12_data_in]
connect_bd_net [get_bd_pins Test_normal_mode_MUX_0/Expansor_output_3] [get_bd_pins bit_order_adjust_tca9538_1/u14_data_in]
connect_bd_net [get_bd_pins bit_order_adjust_tca9538_1/u10_data_out] [get_bd_pins TCA9538_driver_0/data_1_in]
connect_bd_net [get_bd_pins bit_order_adjust_tca9538_1/u12_data_out] [get_bd_pins TCA9538_driver_0/data_2_in]
connect_bd_net [get_bd_pins bit_order_adjust_tca9538_1/u14_data_out] [get_bd_pins TCA9538_driver_0/data_3_in]
connect_bd_net -net NV_parameter_load_0_sp1 [get_bd_pins NV_parameter_load_0/dig_out_18] \
  [get_bd_pins xlconcat_4/In2] [get_bd_pins system_ila_0/probe1]
connect_bd_net [get_bd_pins xlconstant_19/dout] [get_bd_pins xlconcat_0/In1]
connect_bd_net [get_bd_pins De_Multiplexer_8b_0/NOT_data_out_7] [get_bd_pins xlconcat_1/In2] [get_bd_pins xlconcat_2/In6]
connect_bd_net [get_bd_pins NV_parameter_load_0/t_step_C] [get_bd_pins DCbus_dynamic_0/t_step_C] [get_bd_pins system_ila_0/probe2]
connect_bd_net -net DRIVER_UP_03_1 [get_bd_ports DRIVER_UP_03] [get_bd_pins DCbus_dynamic_0/ena_chop_res]
connect_bd_net [get_bd_pins NV_parameter_load_0/DC_bus_fived] [get_bd_pins DCbus_dynamic_0/DC_bus_fixed_volt] [get_bd_pins system_ila_0/probe3]
connect_bd_net [get_bd_pins NV_parameter_load_0/DC_bus_fixed_volt] [get_bd_pins DCbus_dynamic_0/V_DC_voltage_in] [get_bd_pins system_ila_0/probe4]
connect_bd_net [get_bd_pins xlconcat_0/dout] [get_bd_pins lcl_filter_0/CB1_K1_K3_V]
connect_bd_net [get_bd_pins NV_parameter_load_0/phase_step_on] [get_bd_pins system_ila_0/probe5] [get_bd_pins grid_0/phase_step_on]
connect_bd_net [get_bd_pins NV_parameter_load_0/phase_step] [get_bd_pins system_ila_0/probe6] [get_bd_pins grid_0/phase_step]
connect_bd_net [get_bd_pins NV_parameter_load_0/counter_limit] [get_bd_pins system_ila_0/probe7] [get_bd_pins grid_0/counter_limit]
connect_bd_net [get_bd_pins NV_parameter_load_0/amp_a] [get_bd_pins system_ila_0/probe8] [get_bd_pins grid_0/ampl_a]
connect_bd_net [get_bd_pins NV_parameter_load_0/amp_b] [get_bd_pins system_ila_0/probe9] [get_bd_pins grid_0/ampl_b]
connect_bd_net [get_bd_pins NV_parameter_load_0/amp_c] [get_bd_pins system_ila_0/probe10] [get_bd_pins grid_0/ampl_c]
connect_bd_net [get_bd_pins NV_parameter_load_0/inv_seq] [get_bd_pins system_ila_0/probe11] [get_bd_pins grid_0/inv_seq]
connect_bd_net [get_bd_pins NV_parameter_load_0/dt_L1] [get_bd_pins system_ila_0/probe12] [get_bd_pins lcl_filter_0/dT_L1]
connect_bd_net [get_bd_pins NV_parameter_load_0/dt_L2] [get_bd_pins system_ila_0/probe13] [get_bd_pins lcl_filter_0/dT_L2]
connect_bd_net [get_bd_pins NV_parameter_load_0/rC] [get_bd_pins system_ila_0/probe14] [get_bd_pins lcl_filter_0/rC]
connect_bd_net [get_bd_pins parameter_load_2_0/rL2] [get_bd_pins system_ila_0/probe15] [get_bd_pins lcl_filter_0/rL2]
connect_bd_net [get_bd_pins parameter_load_2_0/Preload] [get_bd_pins system_ila_0/probe16] [get_bd_pins lcl_filter_0/Preload]
connect_bd_net [get_bd_pins xlconstant_5/dout] \
  [get_bd_pins gain_offset_truncation_1/in_I_pmsm_a] [get_bd_pins gain_offset_truncation_1/in_I_pmsm_b] \
  [get_bd_pins gain_offset_truncation_1/in_I_pmsm_c] [get_bd_pins gain_offset_truncation_1/in_V_fem_a] \
  [get_bd_pins gain_offset_truncation_1/in_V_fem_b] [get_bd_pins gain_offset_truncation_1/in_V_fem_c]
connect_bd_net [get_bd_pins xlconstant_20/dout] [get_bd_pins xlconcat_2/In0] [get_bd_pins xlconcat_4/In1] [get_bd_pins xlconcat_2/In4]
connect_bd_net [get_bd_pins axi_gpio_0/ip2intc_irpt] [get_bd_pins processing_system7_0/IRQ_F2P]
connect_bd_net [get_bd_pins serial_interrupt_0/Console_1s_interrupt] [get_bd_pins axi_gpio_0/gpio_io_i]
connect_bd_net [get_bd_pins rst_ps7_0_50M/peripheral_aresetn] [get_bd_pins DAC_121s101_0/RST] [get_bd_pins AD1RefComp_0/RST]
connect_bd_net [get_bd_pins rst_ps7_0_10M/peripheral_aresetn] [get_bd_pins AD_5293_v2_0/RST]
connect_bd_net -net FSM_0_Start1 [get_bd_pins start_200ns_0/start_200n] \
  [get_bd_pins grid_bridge3ph_0/ap_start] [get_bd_pins DCbus_dynamic_0/ap_start] [get_bd_pins grid_0/ap_start] \
  [get_bd_pins lcl_filter_0/ap_start] [get_bd_pins gain_offset_truncation_1/ap_start] [get_bd_pins dc_dc_0/ap_start]
connect_bd_net [get_bd_pins FSM_0/Start] [get_bd_pins wind_turb_0/ap_start]
connect_bd_net [get_bd_pins AD_5293_v2_0/D1] [get_bd_ports Din_out_17]
connect_bd_net [get_bd_pins parameter_load_2_0/ena_chop_res] \
  [get_bd_pins three_ph_modulator_0/enable] [get_bd_pins system_ila_0/probe17] [get_bd_pins grid_0/proof_flag_on]
connect_bd_net [get_bd_pins parameter_load_2_0/rL1] [get_bd_pins system_ila_0/probe18] [get_bd_pins lcl_filter_0/rL1]
connect_bd_net [get_bd_pins NV_parameter_load_0/dt_C] [get_bd_pins system_ila_0/probe19] [get_bd_pins lcl_filter_0/dT_C]
connect_bd_net [get_bd_pins xlconstant_12/dout] [get_bd_pins bridge3ph_0/Vdc_V]
connect_bd_net [get_bd_pins DCbus_dynamic_0/V_bus] [get_bd_pins grid_bridge3ph_0/Vdc] [get_bd_pins gain_offset_truncation_1/in_V_dc_bus]
connect_bd_net [get_bd_pins grid_bridge3ph_0/Idc_r] [get_bd_pins DCbus_dynamic_0/I_out]
connect_bd_net [get_bd_pins lcl_filter_0/IL1_a_r] [get_bd_pins grid_bridge3ph_0/Ia] [get_bd_pins gain_offset_truncation_1/in_I_LCL_1_a]
connect_bd_net [get_bd_pins lcl_filter_0/IL1_b_r] [get_bd_pins grid_bridge3ph_0/Ib] [get_bd_pins gain_offset_truncation_1/in_I_LCL_1_b]
connect_bd_net [get_bd_pins lcl_filter_0/IL1_c_r] [get_bd_pins grid_bridge3ph_0/Ic] [get_bd_pins gain_offset_truncation_1/in_I_LCL_1_c]
connect_bd_net [get_bd_pins grid_bridge3ph_0/Va_r] [get_bd_pins lcl_filter_0/V1_a]
connect_bd_net [get_bd_pins grid_bridge3ph_0/Vb_r] [get_bd_pins lcl_filter_0/V1_b]
connect_bd_net [get_bd_pins grid_bridge3ph_0/Vc_r] [get_bd_pins lcl_filter_0/V1_c]
connect_bd_net [get_bd_pins grid_0/Grid_a_r] [get_bd_pins lcl_filter_0/V2_a_s] [get_bd_pins gain_offset_truncation_1/in_V_grid_a]
connect_bd_net [get_bd_pins grid_0/Grid_b_r] [get_bd_pins lcl_filter_0/V2_b_s] [get_bd_pins gain_offset_truncation_1/in_V_grid_b]
connect_bd_net [get_bd_pins grid_0/Grid_c_r] [get_bd_pins lcl_filter_0/V2_c_s] [get_bd_pins gain_offset_truncation_1/in_V_grid_c]
connect_bd_net [get_bd_pins lcl_filter_0/IL2_a_r] [get_bd_pins gain_offset_truncation_1/in_I_LCL_2_a]
connect_bd_net [get_bd_pins lcl_filter_0/IL2_b_r] [get_bd_pins gain_offset_truncation_1/in_I_LCL_2_b]
connect_bd_net [get_bd_pins lcl_filter_0/IL2_c_r] [get_bd_pins gain_offset_truncation_1/in_I_LCL_2_c]
connect_bd_net [get_bd_pins lcl_filter_0/Vp_a_r] [get_bd_pins gain_offset_truncation_1/in_Vp_a]
connect_bd_net [get_bd_pins lcl_filter_0/Vp_b_r] [get_bd_pins gain_offset_truncation_1/in_Vp_b]
connect_bd_net [get_bd_pins lcl_filter_0/Vp_c_r] [get_bd_pins gain_offset_truncation_1/in_Vp_c]
connect_bd_net [get_bd_pins xlconstant_4/dout] [get_bd_pins wind_turb_0/Pi_V]
connect_bd_net [get_bd_pins grid_0/mod_a] [get_bd_pins three_ph_modulator_0/mod_a]
connect_bd_net [get_bd_pins grid_0/mod_b] [get_bd_pins three_ph_modulator_0/mod_b]
connect_bd_net [get_bd_pins grid_0/mod_c] [get_bd_pins three_ph_modulator_0/mod_c]
connect_bd_net [get_bd_pins grid_0/I_out_proof] [get_bd_pins DCbus_dynamic_0/I_in]
connect_bd_net [get_bd_pins IGBT_input_selector_0/grid_T1] [get_bd_pins three_ph_modulator_0/in_T1]
connect_bd_net [get_bd_pins IGBT_input_selector_0/grid_T2] [get_bd_pins three_ph_modulator_0/in_T2]
connect_bd_net [get_bd_pins IGBT_input_selector_0/grid_T3] [get_bd_pins three_ph_modulator_0/in_T3]
connect_bd_net [get_bd_pins IGBT_input_selector_0/grid_T4] [get_bd_pins three_ph_modulator_0/in_T4]
connect_bd_net [get_bd_pins IGBT_input_selector_0/grid_T5] [get_bd_pins three_ph_modulator_0/in_T5]
connect_bd_net [get_bd_pins IGBT_input_selector_0/grid_T6] [get_bd_pins three_ph_modulator_0/in_T6]
connect_bd_net [get_bd_pins three_ph_modulator_0/T1] [get_bd_pins dc_dc_0/T1]
connect_bd_net [get_bd_pins three_ph_modulator_0/T2] [get_bd_pins dc_dc_0/T2]
connect_bd_net [get_bd_pins three_ph_modulator_0/T3] [get_bd_pins dc_dc_0/T3]
connect_bd_net [get_bd_pins three_ph_modulator_0/T4] [get_bd_pins dc_dc_0/T4]
connect_bd_net [get_bd_pins three_ph_modulator_0/T5] [get_bd_pins dc_dc_0/T5]
connect_bd_net [get_bd_pins three_ph_modulator_0/T6] [get_bd_pins dc_dc_0/T6]
connect_bd_net [get_bd_pins grid_bridge3ph_0/V_n_gnd_r] [get_bd_pins dc_dc_0/V_N_gnd]
connect_bd_net [get_bd_pins dc_dc_0/V_N_gnd_out] [get_bd_pins lcl_filter_0/VN_gnd]
connect_bd_net [get_bd_pins dc_dc_0/T1_out] [get_bd_pins grid_bridge3ph_0/T1] [get_bd_pins system_ila_0/probe21] [get_bd_ports Din_out_18]
connect_bd_net [get_bd_pins dc_dc_0/T2_out] [get_bd_pins grid_bridge3ph_0/T2] [get_bd_pins system_ila_0/probe22] [get_bd_ports Din_out_20]
connect_bd_net [get_bd_pins dc_dc_0/T3_out] [get_bd_pins grid_bridge3ph_0/T3] [get_bd_pins system_ila_0/probe23]
connect_bd_net [get_bd_pins dc_dc_0/T4_out] [get_bd_pins grid_bridge3ph_0/T4] [get_bd_pins system_ila_0/probe24]
connect_bd_net [get_bd_pins dc_dc_0/T5_out] [get_bd_pins grid_bridge3ph_0/T5] [get_bd_pins system_ila_0/probe25]
connect_bd_net [get_bd_pins dc_dc_0/T6_out] [get_bd_pins grid_bridge3ph_0/T6] [get_bd_pins system_ila_0/probe26]
connect_bd_net [get_bd_pins parameter_load_2_0/dc_dc_enable] [get_bd_pins dc_dc_0/enable] [get_bd_pins system_ila_0/probe20]

# ---- address map ----
assign_bd_address -offset 0x41200000 -range 64K -target_address_space [get_bd_addr_spaces processing_system7_0/Data] [get_bd_addr_segs axi_gpio_0/S_AXI/Reg]
assign_bd_address -offset 0x43C00000 -range 64K -target_address_space [get_bd_addr_spaces processing_system7_0/Data] [get_bd_addr_segs NV_parameter_load_0/S00_AXI/S00_AXI_reg]
assign_bd_address -offset 0x43C10000 -range 64K -target_address_space [get_bd_addr_spaces processing_system7_0/Data] [get_bd_addr_segs NV_io_controller_0/S00_AXI/S00_AXI_reg]
assign_bd_address -offset 0x43C20000 -range 64K -target_address_space [get_bd_addr_spaces processing_system7_0/Data] [get_bd_addr_segs parameter_load_2_0/S00_AXI/S00_AXI_reg]

validate_bd_design
save_bd_design
